# Altium schematic sheet Pg09_1G_b.SchDoc: 10/100/1G PHY
size A3; DocumentNumber: 9; SheetNumber: 9; SheetTotal: 16
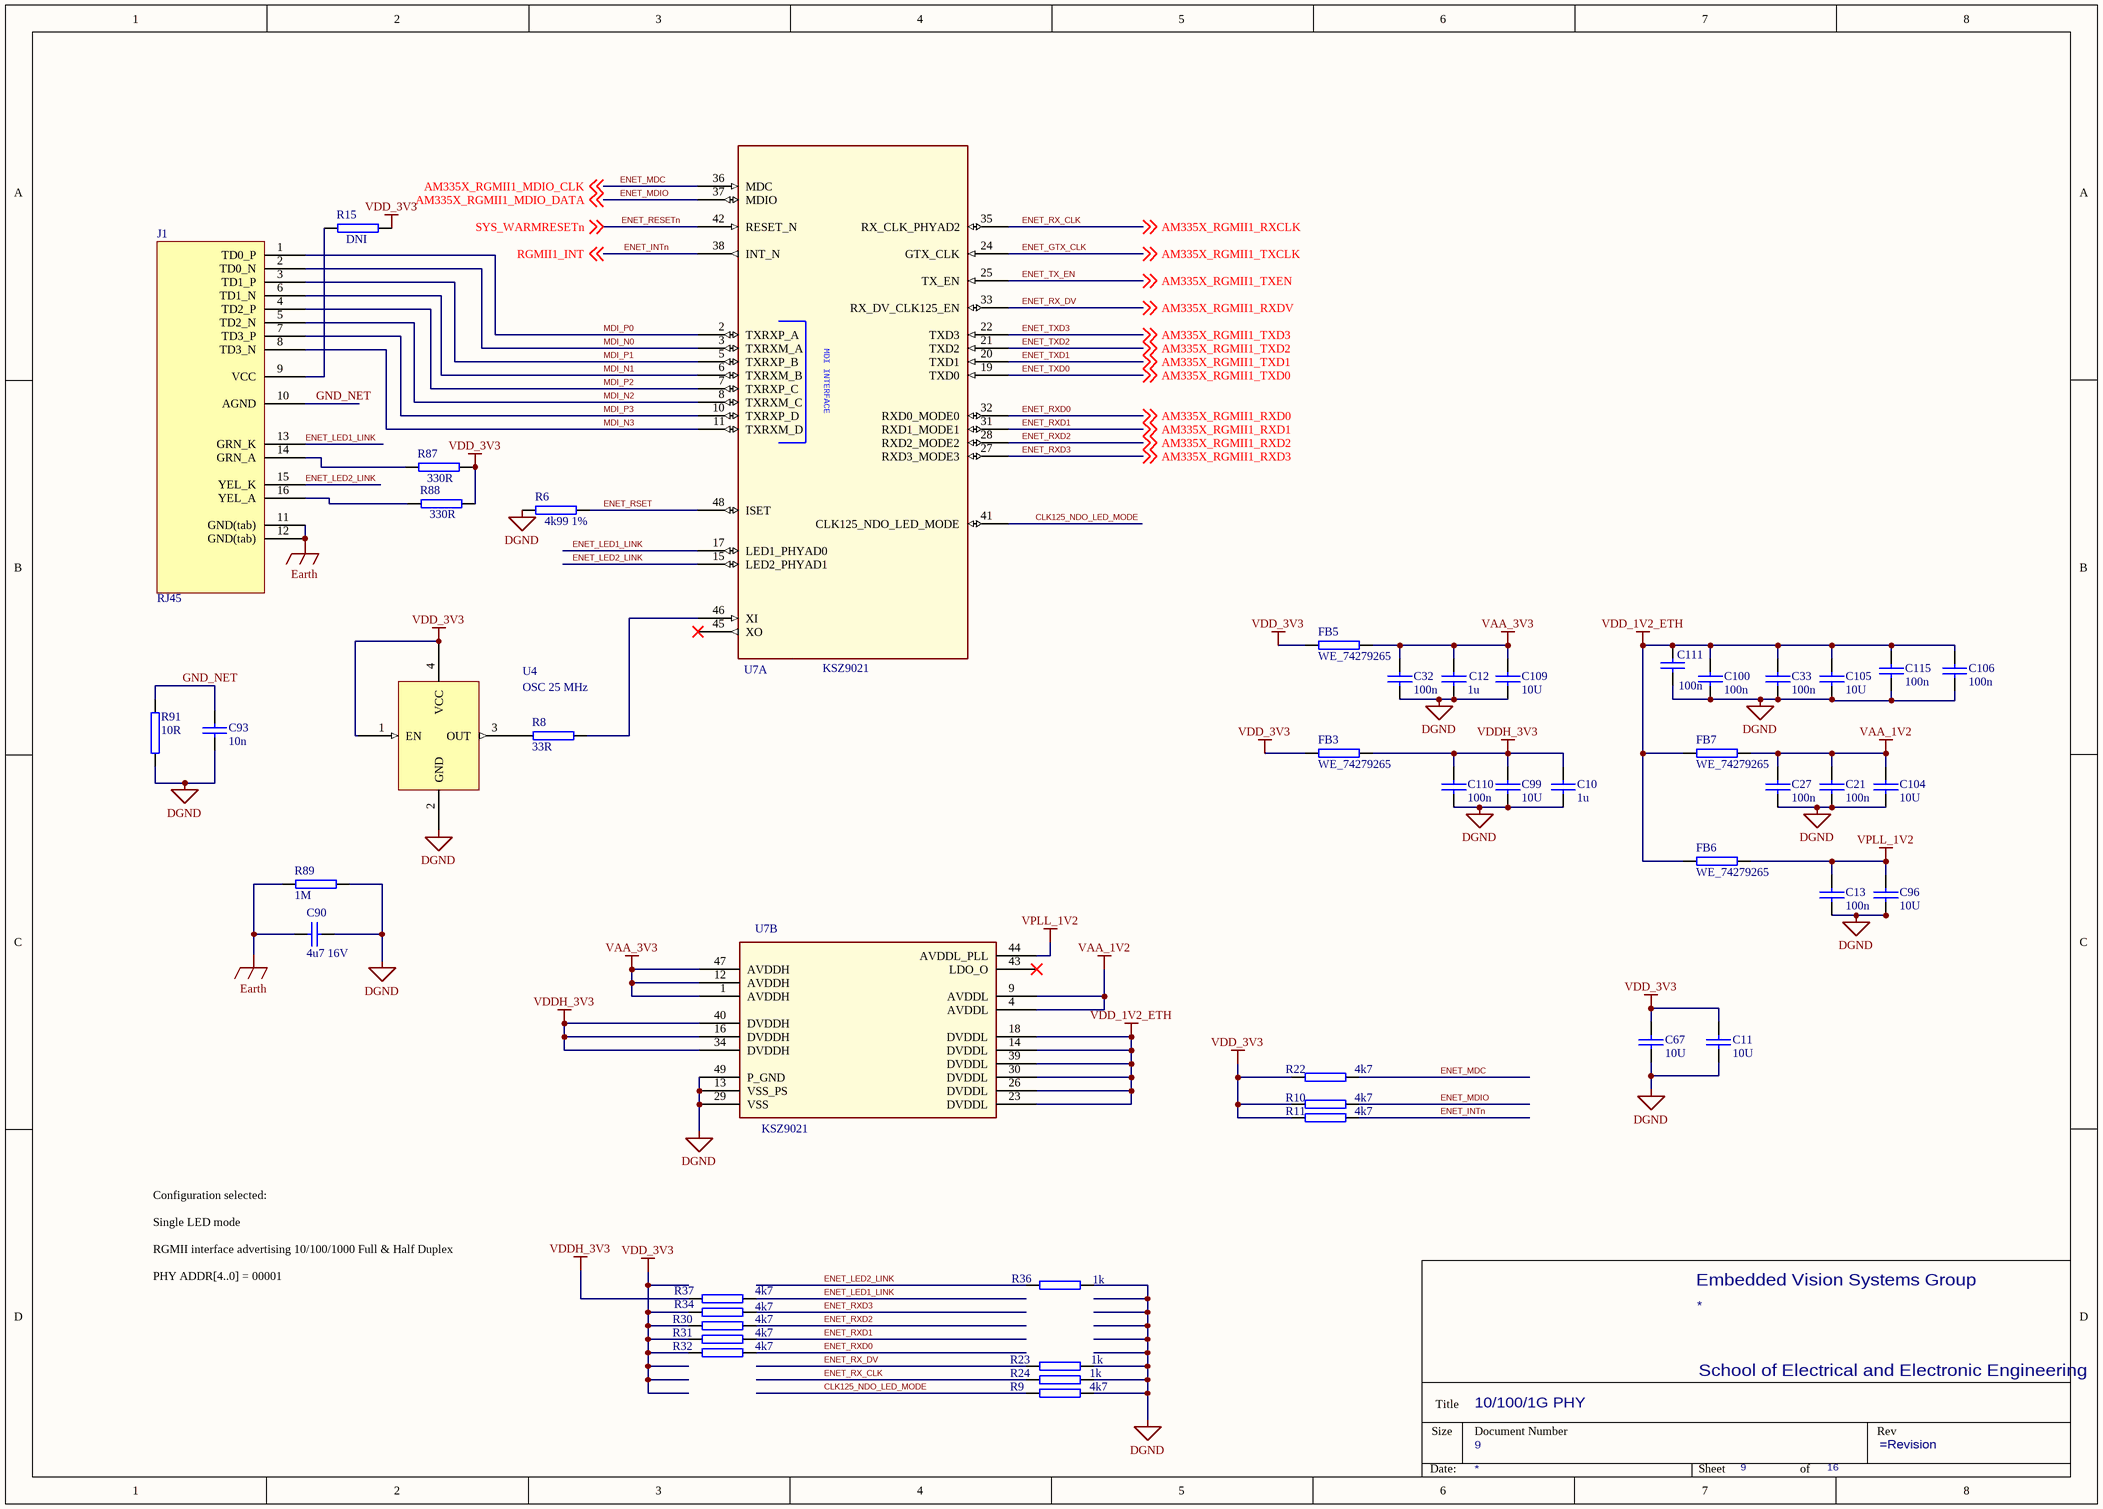
[diagram p0: Pg09_1G_b.SchDoc]

## Parts
?  (no value)  (graphical)
C10  1u  [0603]
C11  10U  [0603]
C12  1u  [0603]
C13  100n  [SM-7351-CAP-0402]
C21  100n  [SM-7351-CAP-0402]
C27  100n  [SM-7351-CAP-0402]
C32  100n  [0603]
C33  100n  [sc0402]
C67  10U  [0603]
C90  4u7 16V  [0603]
C93  10n  [0603]
C96  10U  [0603]
C99  10U  [0603]
C100  100n  [SM-7351-CAP-0402]
C104  10U  [0603]
C105  10U  [0603]
C106  100n  [0603]
C109  10U  [0603]
C110  100n  [0603]
C111  100n  [0603]
C115  100n  [SM-7351-CAP-0402]
FB3  WE_74279265  [0603]
FB5  WE_74279265  [0603]
FB6  WE_74279265  [0603]
FB7  WE_74279265  [0603]
J1  RJ45  [RJ45_tripleSpeed]
R6  4k99 1%  [sc0402]
R8  33R  [sc0402]
R9  4k7  [sc0402]
R10  4k7  [sc0402]
R11  4k7  [sc0402]
R15  DNI  [sc0402]
R22  4k7  [sc0402]
R23  1k  [sc0402]
R24  1k  [sc0402]
R30  4k7  [sc0402]
R31  4k7  [sc0402]
R32  4k7  [sc0402]
R34  4k7  [sc0402]
R36  1k  [sc0402]
R37  4k7  [sc0402]
R87  330R  [sc0402]
R88  330R  [sc0402]
R89  1M  [0603]
R91  10R  [0603]
U4  OSC 25 MHz  [Osc 3.2x2.5]
U7  KSZ9021  [QFN48_0.5mmPitch]  (parts A,B of 2)

## Nets
DGND: C10.2 C11.2 C12.2 C13.2 C21.2 C27.2 C32.2 C33.2 C67.2 C90.2 C93.2 C96.2 C99.2 C100.2 C104.2 C105.2 C106.2 C109.2 C110.2 C111.2 C115.2 R6.1 R9.2 R23.2 R24.2 R36.2 R89.1 R91.1 U4.2(GND) U7.13(VSS_PS) U7.29(VSS) U7.49(P_GND)
Earth: C90.1 J1.11(GND(tab)) J1.12(GND(tab)) R89.2
VAA_1V2: C21.1 C27.1 C104.1 FB7.2 U7.4(AVDDL) U7.9(AVDDL)
VAA_3V3: C12.1 C32.1 C109.1 FB5.2 U7.1(AVDDH) U7.12(AVDDH) U7.47(AVDDH)
VDD_1V2_ETH: C33.1 C100.1 C105.1 C106.1 C111.1 C115.1 FB6.1 FB7.1 U7.14(DVDDL) U7.18(DVDDL) U7.23(DVDDL) U7.26(DVDDL) U7.30(DVDDL) U7.39(DVDDL)
VDD_3V3: C11.1 C67.1 FB3.1 FB5.1 R10.1 R11.1 R15.2 R22.1 R30.1 R31.1 R32.1 R34.1 R87.2 R88.2 U4.1(EN) U4.4(VCC)
VDDH_3V3: C10.1 C99.1 C110.1 FB3.2 R37.1 U7.16(DVDDH) U7.34(DVDDH) U7.40(DVDDH)
VPLL_1V2: C13.1 C96.1 FB6.2 U7.44(AVDDL_PLL)
CLK125_NDO_LED_MODE: R9.1 U7.41(CLK125_NDO_LED_MODE)
ENET_GTX_CLK: U7.24(GTX_CLK) ; off-sheet AM335X_RGMII1_TXCLK  [also labelled AM335X_RGMII1_TXCLK]
ENET_INTn: R11.2 U7.38(INT_N) ; off-sheet RGMII1_INT  [also labelled RGMII1_INT]
ENET_LED1_LINK: J1.13(GRN_K) R37.2 U7.17(LED1_PHYAD0)
ENET_LED2_LINK: J1.15(YEL_K) R36.1 U7.15(LED2_PHYAD1)
ENET_MDC: R22.2 U7.36(MDC) ; off-sheet AM335X_RGMII1_MDIO_CLK  [also labelled AM335X_RGMII1_MDIO_CLK]
ENET_MDIO: R10.2 U7.37(MDIO) ; off-sheet AM335X_RGMII1_MDIO_DATA  [also labelled AM335X_RGMII1_MDIO_DATA]
ENET_RESETn: U7.42(RESET_N) ; off-sheet SYS_WARMRESETn  [also labelled SYS_WARMRESETn]
ENET_RSET: R6.2 U7.48(ISET)
ENET_RX_CLK: R24.1 U7.35(RX_CLK_PHYAD2) ; off-sheet AM335X_RGMII1_RXCLK  [also labelled AM335X_RGMII1_RXCLK]
ENET_RX_DV: R23.1 U7.33(RX_DV_CLK125_EN) ; off-sheet AM335X_RGMII1_RXDV  [also labelled AM335X_RGMII1_RXDV]
ENET_RXD0: R32.2 U7.32(RXD0_MODE0) ; off-sheet AM335X_RGMII1_RXD0  [also labelled AM335X_RGMII1_RXD0]
ENET_RXD1: R31.2 U7.31(RXD1_MODE1) ; off-sheet AM335X_RGMII1_RXD1  [also labelled AM335X_RGMII1_RXD1]
ENET_RXD2: R30.2 U7.28(RXD2_MODE2) ; off-sheet AM335X_RGMII1_RXD2  [also labelled AM335X_RGMII1_RXD2]
ENET_RXD3: R34.2 U7.27(RXD3_MODE3) ; off-sheet AM335X_RGMII1_RXD3  [also labelled AM335X_RGMII1_RXD3]
ENET_TX_EN: U7.25(TX_EN) ; off-sheet AM335X_RGMII1_TXEN  [also labelled AM335X_RGMII1_TXEN]
ENET_TXD0: U7.19(TXD0) ; off-sheet AM335X_RGMII1_TXD0  [also labelled AM335X_RGMII1_TXD0]
ENET_TXD1: U7.20(TXD1) ; off-sheet AM335X_RGMII1_TXD1  [also labelled AM335X_RGMII1_TXD1]
ENET_TXD2: U7.21(TXD2) ; off-sheet AM335X_RGMII1_TXD2  [also labelled AM335X_RGMII1_TXD2]
ENET_TXD3: U7.22(TXD3) ; off-sheet AM335X_RGMII1_TXD3  [also labelled AM335X_RGMII1_TXD3]
GND_NET: C93.1 J1.10(AGND) R91.2
MDI_N0: J1.2(TD0_N) U7.3(TXRXM_A)
MDI_N1: J1.6(TD1_N) U7.6(TXRXM_B)
MDI_N2: J1.5(TD2_N) U7.8(TXRXM_C)
MDI_N3: J1.8(TD3_N) U7.11(TXRXM_D)
MDI_P0: J1.1(TD0_P) U7.2(TXRXP_A)
MDI_P1: J1.3(TD1_P) U7.5(TXRXP_B)
MDI_P2: J1.4(TD2_P) U7.7(TXRXP_C)
MDI_P3: J1.7(TD3_P) U7.10(TXRXP_D)
NetJ1_9: J1.9(VCC) R15.1
NetJ1_14: J1.14(GRN_A) R87.1
NetJ1_16: J1.16(YEL_A) R88.1
NetR8_1: R8.1 U4.3(OUT)
NetR8_2: R8.2 U7.46(XI)

Not connected (* = marked no-connect by the designer): U7 43(LDO_O)* 45(XO)*

## Notes on the sheet
- Configuration selected:
  Single LED mode
  RGMII interface advertising 10/100/1000 Full & Half Duplex
  PHY ADDR[4..0] = 00001
- Embedded Vision Systems Group
- School of Electrical and Electronic Engineering
- Size
- Title
- Document Number
- Rev
- Date:
- Sheet
- of
- (in symbol KSZ9021RN_4, part A) MDI INTERFACE

## Library data of the parts
? = Title Block Address(1): UoM title block
C10 C106 = CAP: NON-POLARISED CAP
C11-C13 C21 C27 C32 C33 C67 C90 C93 C96 C99 C100 C104 C105 C109-C111 C115 = CAP: NON-POLARISED CAP; Part Field 1: 1; Part Field 10: 1000u; Part Field 2: 0; Part Field 3: 0; Part Field 4: 0; Part Field 5: 1; Part Field 6: 1000K; Part Field 7: 1u; Part Field 8: 1u; Part Field 9: 500u
FB3 FB5-FB7 = WE_74279265: Wurth Eleckronik 0603 ferrite bead pn 74279265
J1 = WE_7499111121A RJ45 triple speed: RJ45 Mag Jack triple speed
R6 R8-R11 R15 R22-R24 R30-R32 R34 R36 R37 R87-R89 R91 = RES: RESISTOR
U4 = OSC: XTAL OSCILLATOR MODULE
U7 = KSZ9021RN_4